# Altium schematic sheet AMP_BB.SchDoc
size A; SheetNumber: 8; SheetTotal: 9
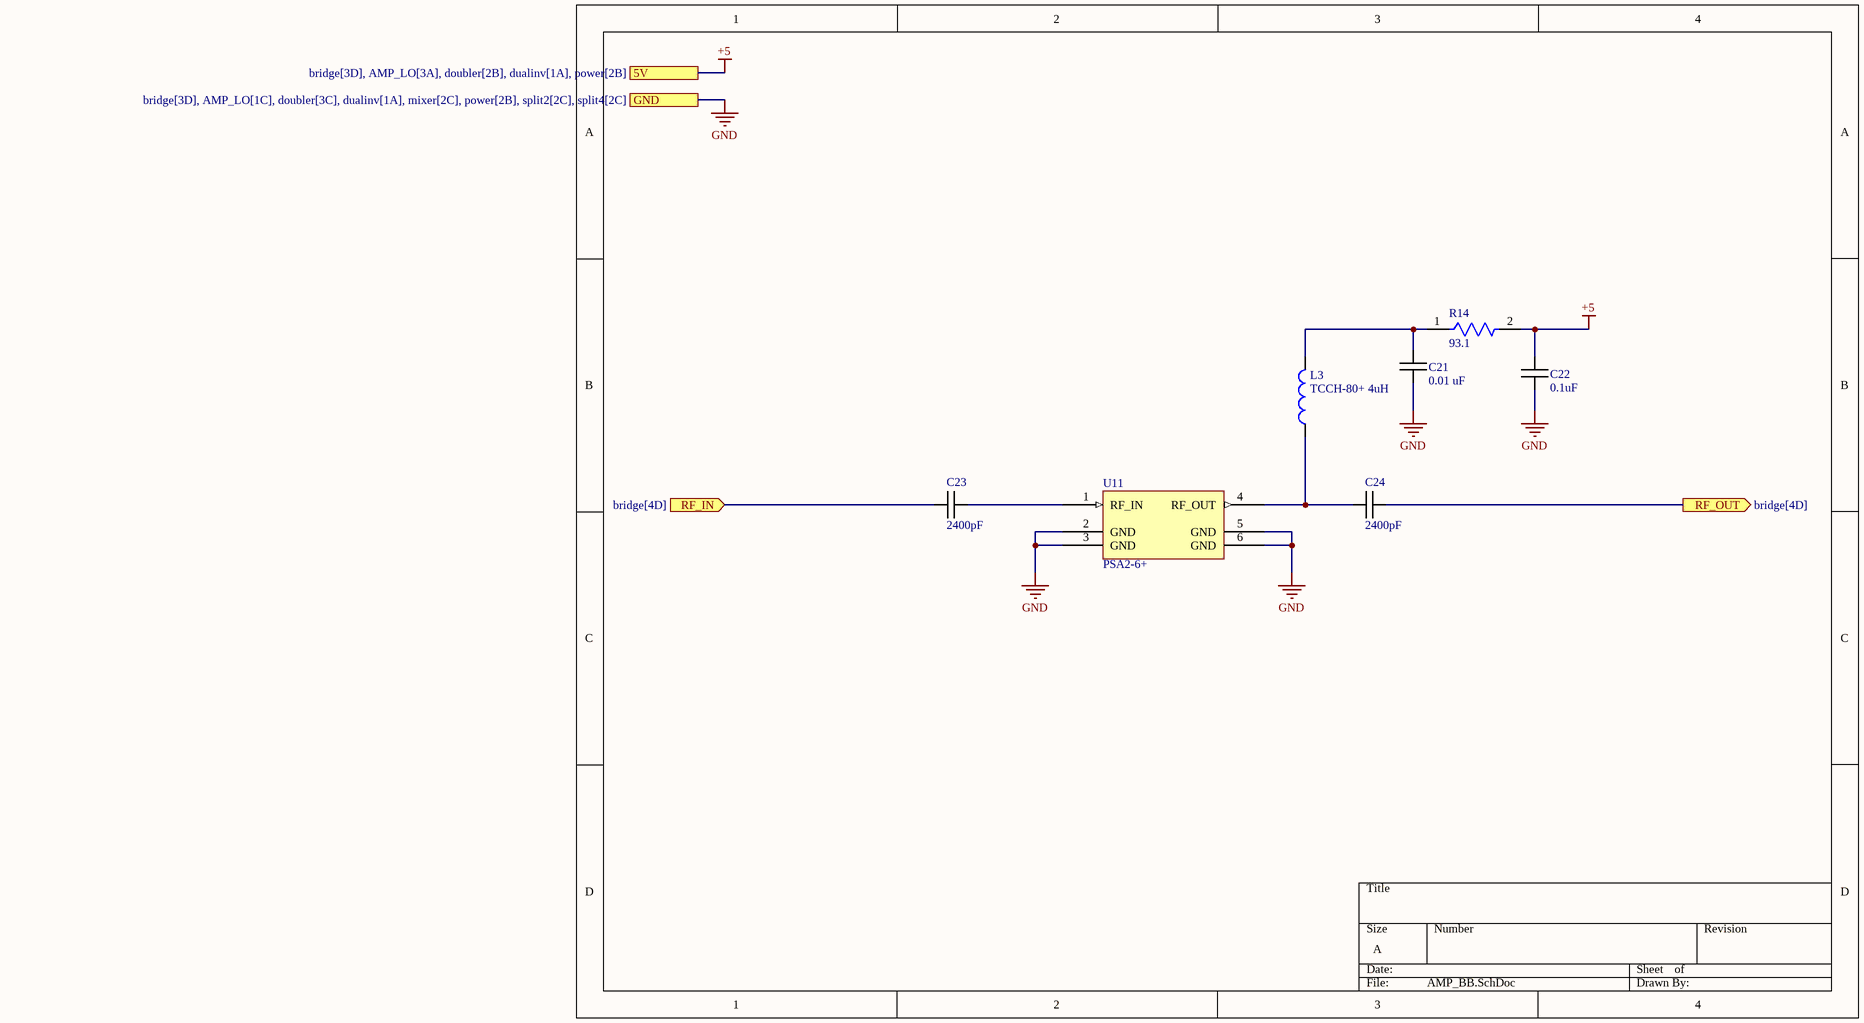
[diagram p0: AMP_BB.SchDoc]

## Parts
C21  0.01 uF  [CAP0603_10000pF]
C22  0.1uF  [CAPC1608X90N]
C23  2400pF  [CAPC1608X90N]
C24  2400pF  [CAPC1608X90N]
L3  TCCH-80+ 4uH  [TCCH-80+]
R14  93.1  [FP-CRCW0805-e3-MFG]
U11  PSA2-6+  [PSA2-6+ SOT-363]

## Ports
5V (see bridge[3D], AMP_LO[3A], doubler[2B], dualinv[1A], power[2B]), GND (see bridge[3D], AMP_LO[1C], doubler[3C], dualinv[1A], mixer[2C], power[2B], split2[2C], split4[2C]), RF_IN (in, see bridge[4D]), RF_OUT (out, see bridge[4D])

## Nets
+5: C22.2 R14.2 ; port 5V
GND: C21.1 C22.1 U11.2(GND) U11.3(GND) U11.5(GND) U11.6(GND) ; port GND
RF_IN: C23.1 ; port RF_IN
RF_OUT: C24.2 ; port RF_OUT
NetC21_2: C21.2 L3.3 R14.1
NetC23_2: C23.2 U11.1(RF_IN)
NetC24_1: C24.1 L3.1 U11.4(RF_OUT)

## Library data of the parts
C21 = GCM1885C1H103JA16D: SMD Capacitor C0G(EIA) with Capacitance: 10000pF Tol. 5%. Rated Voltage: 50Vdc; Manufacturer: Murata; Part Number: GCM1885C1H103JA16D; Supplier 1: Mouser; Supplier Part Number 1: 81-GCM1885C1H103JA6D
C22 = GCM188L81H104KA57D: SMD Capacitor X8L(MURATA) with Capacitance: 0.10uF Tol. 10%. Rated Voltage: 50Vdc; Supplier 1: Mouser; Supplier Part Number 1: 81-GCM188L81H104KA7D; Manufacturer: Murata; Part Number: GCM188L81H104KA57D
C23 C24 = GCM1885C1H242FA16J: CAP CER 2400PF 50V C0G/NP0 0603; Manufacturer: Murata; Supplier 1: Mouser; Supplier Part Number 1: 81-GCM1885C1H242FA6J; Part Number: GCM1885C1H242FA16J
L3 = TCCH-80+: SMT RF Choke 50 MHz - 8.2 GHz, 50Ω; Manufacturer: Mini-Circuits; Part Number: TCCH-80+; Supplier 1: Digikey; Supplier Part Number 1: 3157-TCCH-80+CT-ND
R14 = CMP-2001-04168-2: RES Thick Film, 93.1Ω, 1%, 0.125W, 100ppm/°C, 0805; Part Number: ERJ-6ENF93R1V; Manufacturer: Panasonic; Resistance: 93.1R; Voltage Rating: 150V; Power Rating: 125mW; Tolerance: 1%; Features: Automotive AEC-Q200; Number of Terminations: 2; Case Code (Metric): 2012; Mount: Surface Mount; Case Code (Imperial): 0805; Temperature Coefficient: 100ppm/°C; Composition: Thick Film; Depth: 1.25mm; Case/Package: 0805; Width: 1.25mm; Voltage Rating (DC): 150V; Height: 0.02inch; Radiation Hardening: No; Contact Plating: Tin; Min Operating Temperature: -55°C; Max Power Dissipation: 125mW; Supplier 1: Digikey; Supplier Part Number 1: P93.1CCT-ND
U11 = PSA2-6+: SMT MMIC, Linear, Gain Block Amplifier, DC to 7000 MHz, 50Ω, SOT-363 Style Package; Manufacturer: Mini-Circuits; Supplier 1: Mouser; Supplier Part Number 1: 139-PSA2-6+; Part Number: PSA2-6+